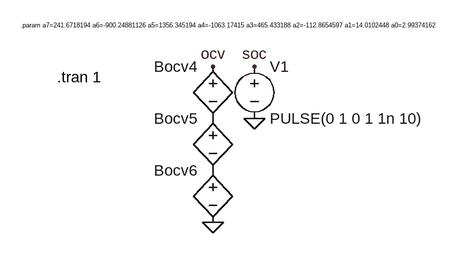
[diagram p0: schematic test-battery_model-ocv.asc]
test-battery_model-ocv.asc, the LTspice schematic file:
Version 4
SHEET 1 2556 680
FLAG 224 176 0
FLAG 160 96 ocv
FLAG 224 96 soc
FLAG 160 336 0
SYMBOL voltage 224 80 R0
WINDOW 123 0 0 Left 0
WINDOW 39 0 0 Left 0
SYMATTR InstName V1
SYMATTR Value PULSE(0 1 0 1 1n 10)
SYMBOL bv 160 80 M0
WINDOW 3 24 96 Invisible 0
SYMATTR Value V={a7}*V(soc)**7+{a6}*V(soc)**6
SYMATTR InstName Bocv4
SYMBOL bv 160 160 M0
WINDOW 3 24 96 Invisible 0
SYMATTR Value V={a5}*V(soc)**5+{a4}*V(soc)**4+{a3}*V(soc)**3
SYMATTR InstName Bocv5
SYMBOL bv 160 240 M0
WINDOW 3 24 96 Invisible 0
SYMATTR Value V={a2}*V(soc)**2+{a1}*V(soc)+{a0}
SYMATTR InstName Bocv6
TEXT -80 112 Left 2 !.tran 1
TEXT -136 32 Left 0 !.param a7=241.6718194 a6=-900.24881126 a5=1356.345194 a4=-1063.17415 a3=465.433188 a2=-112.8654597 a1=14.0102448 a0=2.99374162

The netlist it stands for:
* test-battery_model-ocv.asc
V1 soc 0 PULSE(0 1 0 1 1n 10)
Bocv4 ocv P001 V={a7}*V(soc)**7+{a6}*V(soc)**6
Bocv5 P001 P002 V={a5}*V(soc)**5+{a4}*V(soc)**4+{a3}*V(soc)**3
Bocv6 P002 0 V={a2}*V(soc)**2+{a1}*V(soc)+{a0}
.tran 1
.param a7=241.6718194 a6=-900.24881126 a5=1356.345194 a4=-1063.17415 a3=465.433188 a2=-112.8654597 a1=14.0102448 a0=2.99374162
.backanno
.end